# EAGLE schematic LED board  (EAGLE 6.1)
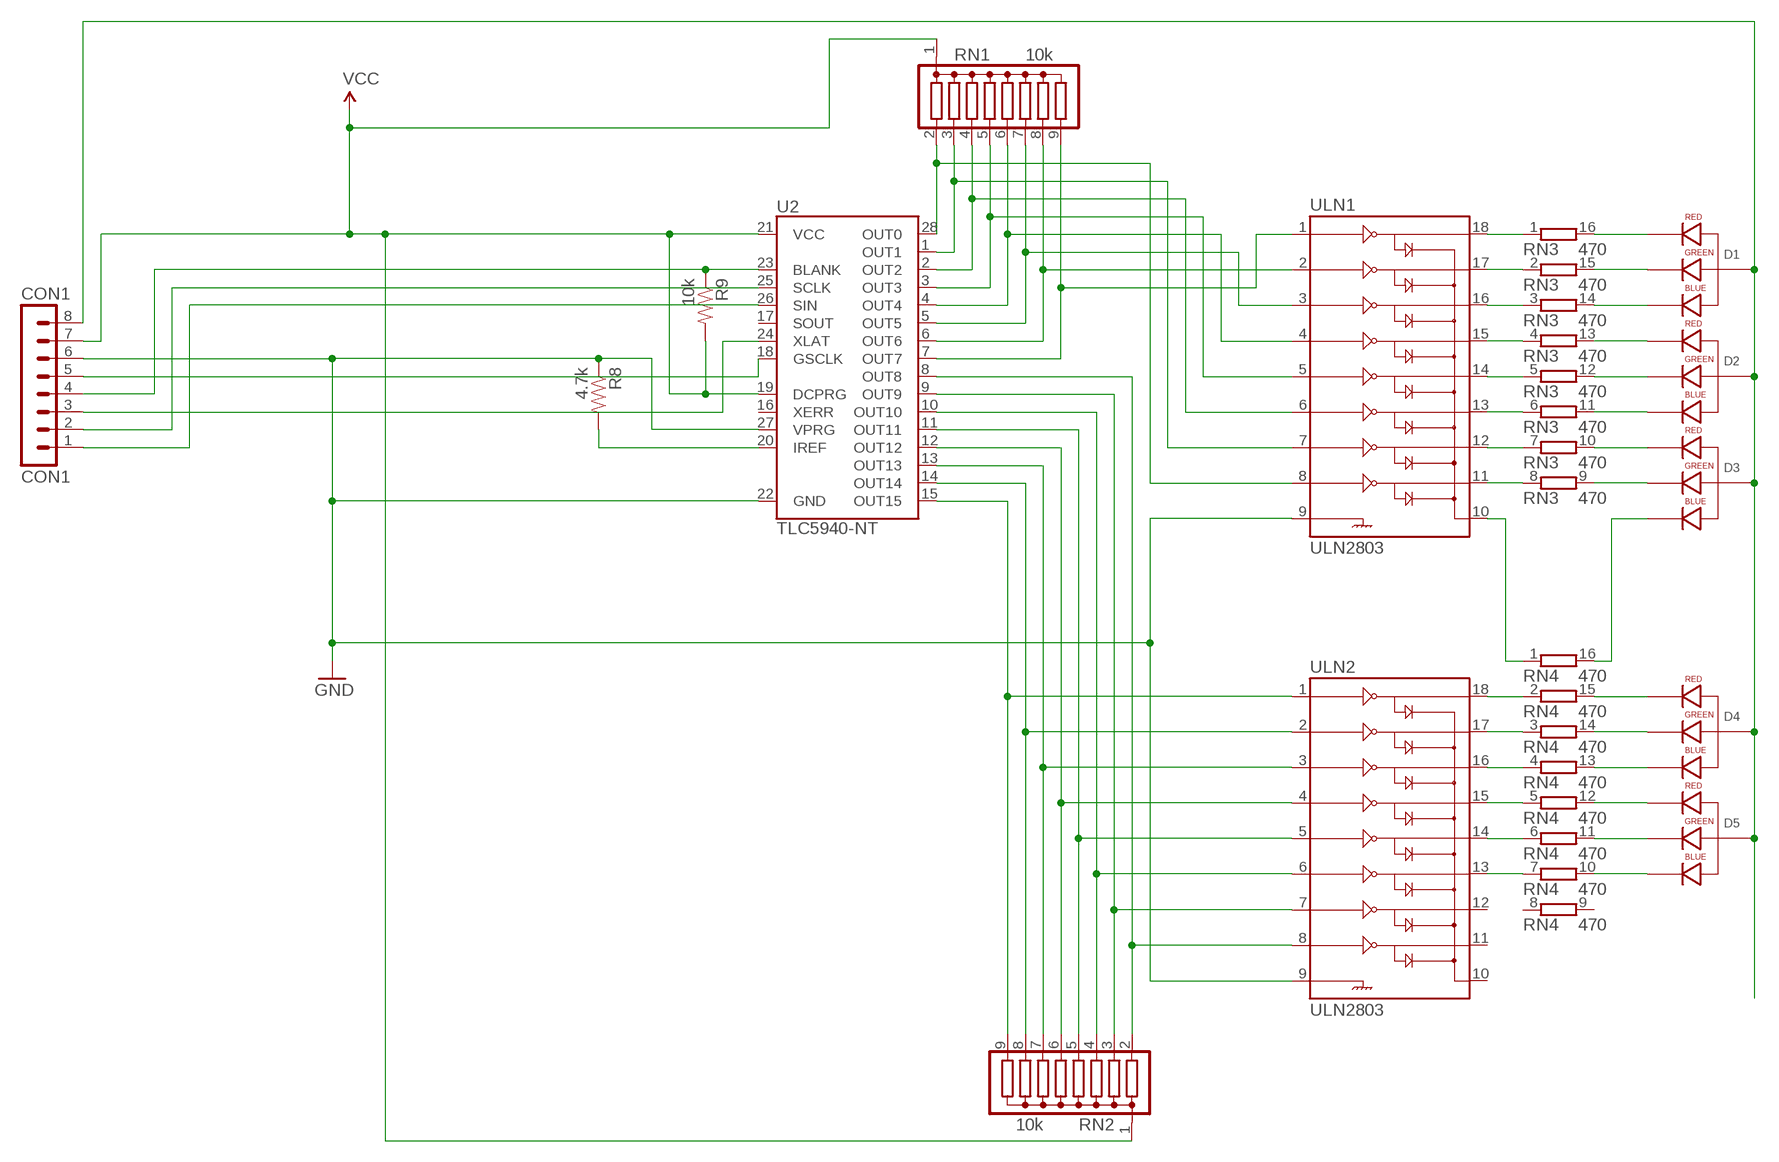
[diagram p0: schematic, sheet 1]

## Parts
CON1  CON1  MA08-1  [MA08-1]
D1  LED-RGB-CA-THRUCLEAR  [LED-RGB-THRU]
D2  LED-RGB-CA-THRUCLEAR  [LED-RGB-THRU]
D3  LED-RGB-CA-THRUCLEAR  [LED-RGB-THRU]
D4  LED-RGB-CA-THRUCLEAR  [LED-RGB-THRU]
D5  LED-RGB-CA-THRUCLEAR  [LED-RGB-THRU]
R8  4.7k  RESISTORPTH-1/2W  [AXIAL-0.5]
R9  10k  RESISTORPTH-1/2W  [AXIAL-0.5]
RN1  10k  G08R  [SIL9]
RN2  10k  G08R  [SIL9]
RN3  470  8R-P  [DIL16]
RN4  470  8R-P  [DIL16]
U2  TLC5940-NT  [DIL28-3]
ULN1  ULN2803  ULN2803DIP  [DIL18]
ULN2  ULN2803  ULN2803DIP  [DIL18]

## Nets
GND: CON1.6 R8.P$1 U2.22(GND) U2.27(VPRG) ULN1.9 ULN2.9
N$2: RN3.1 ULN1.18
N$3: RN3.2 ULN1.17
N$4: RN3.3 ULN1.16
N$5: RN3.4 ULN1.15
N$6: RN3.5 ULN1.14
N$7: RN3.6 ULN1.13
N$8: R8.P$2 U2.20(IREF)
N$9: CON1.4 R9.P$1 U2.23(BLANK)
N$10: CON1.5 U2.18(GSCLK)
N$11: CON1.3 U2.24(XLAT)
N$12: CON1.2 U2.25(SCLK)
N$13: CON1.1 U2.26(SIN)
N$14: RN2.2 U2.8(OUT8) ULN2.8
N$15: RN1.2 U2.28(OUT0) ULN1.8
N$16: RN1.3 U2.1(OUT1) ULN1.7
N$17: RN1.4 U2.2(OUT2) ULN1.6
N$18: RN1.5 U2.3(OUT3) ULN1.5
N$19: RN1.6 U2.4(OUT4) ULN1.4
N$20: RN1.7 U2.5(OUT5) ULN1.3
N$21: RN1.8 U2.6(OUT6) ULN1.2
N$22: RN1.9 U2.7(OUT7) ULN1.1
N$23: RN2.3 U2.9(OUT9) ULN2.7
N$24: RN2.4 U2.10(OUT10) ULN2.6
N$25: RN2.5 U2.11(OUT11) ULN2.5
N$26: RN2.6 U2.12(OUT12) ULN2.4
N$27: RN2.7 U2.13(OUT13) ULN2.3
N$28: RN2.8 U2.14(OUT14) ULN2.2
N$29: RN2.9 U2.15(OUT15) ULN2.1
N$30: RN3.7 ULN1.12
N$31: RN3.8 ULN1.11
N$32: D1.1(RED_CATHODE) RN3.16
N$33: D1.3(GREEN_CATHODE) RN3.15
N$34: D1.4(BLUE_CATHODE) RN3.14
N$35: D2.1(RED_CATHODE) RN3.13
N$36: D2.3(GREEN_CATHODE) RN3.12
N$37: D2.4(BLUE_CATHODE) RN3.11
N$38: D3.1(RED_CATHODE) RN3.10
N$39: D3.3(GREEN_CATHODE) RN3.9
N$40: RN4.1 ULN1.10
N$41: D3.4(BLUE_CATHODE) RN4.16
N$42: RN4.2 ULN2.18
N$43: RN4.3 ULN2.17
N$44: RN4.4 ULN2.16
N$45: RN4.5 ULN2.15
N$46: RN4.6 ULN2.14
N$47: RN4.7 ULN2.13
N$49: D4.1(RED_CATHODE) RN4.15
N$50: D4.3(GREEN_CATHODE) RN4.14
N$51: D4.4(BLUE_CATHODE) RN4.13
N$52: D5.1(RED_CATHODE) RN4.12
N$53: D5.3(GREEN_CATHODE) RN4.11
N$54: D5.4(BLUE_CATHODE) RN4.10
VCC: CON1.7 R9.P$2 RN1.1 RN2.1 U2.19(DCPRG) U2.21(VCC)
VCC+12: CON1.8 D1.2(ANODE) D2.2(ANODE) D3.2(ANODE) D4.2(ANODE) D5.2(ANODE)
Unconnected: RN4.8 RN4.9 U2.16(XERR) U2.17(SOUT) ULN2.10 ULN2.11 ULN2.12

## Library data of the parts
CON1 = con-lstb:MA08-1: PIN HEADER; OC_FARNELL: unknown; OC_NEWARK: unknown
D1-D5 = SparkFun-LED:LED-RGB-CA-THRU: RGB Through-hole common anode SparkFun store front COM-10821 (diffuse) COM-10820 (clear); PROD_ID: DIO-10631
R8 R9 = SparkFun-Passives:RESISTOR: Resistor Basic schematic elements and footprints for 0603, 1206, and PTH resistors.
RN1 RN2 = resistor-sil:G08R: SIL RESISTOR; OC_FARNELL: unknown; OC_NEWARK: unknown
RN3 RN4 = resistor-dil:8R-P: DIL RESISTOR; OC_FARNELL: unknown; OC_NEWARK: unknown
U2 = SparkFun-DigitalIC:TLC5940: 16-channel LED Driver with Dot Correction and Grayscale PWM Control The TLC5940 is a 16-channel, constant-current sink LED driver. Each channel has an individually adjustable 4096-step grayscale PWM brightness control and a 64-step, constant-current sink (dot correction). The dot correction adjusts the brightness variations between LED channels and other LED drivers. The dot correction data is stored in an integrated EEPROM. Both grayscale control and dot correction are accessible via a serial interface. A single external resistor sets the maximum current value of all 16 channels. Packages: 28-pin HTSSOP 32-pin 5x5mm QFN 28-pin DIP
ULN1 ULN2 = SparkFun-PowerIC:ULN2803: Darlington Driver ULN2803 Darlington array. 500mA max per channel, 8-channel package. Spark Fun Electronics SKU : COM-00312